# Altium schematic sheet hot.SchDoc
size A2
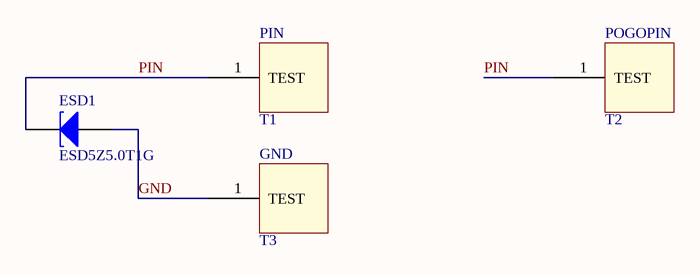
[diagram p0: hot.SchDoc]

## Parts
ESD1  ESD5Z5.0T1G  [LC-SOD-523]
GND  T3  [PIN]
PIN  T1  [PIN]
POGOPIN  T2  [POGOPIN]

## Nets
GND: ESD1.1(A) GND.1(TEST)
PIN: ESD1.2(K) PIN.1(TEST) POGOPIN.1(TEST)

## Library data of the parts
ESD1 = D Tunnel2: Tunnel Diode - Dependent Source Model; Published: 15-Apr-2002; LatestRevisionDate: 17-Jul-2002; LatestRevisionNote: Re-released for DXP Platform.; PackageReference: DIODE-0.4; Publisher: Altium Limited; PackageDescription: Diode, Thru-Hole; 2 Leads; 0.4 in Pin Spacing
GND PIN POGOPIN = TEST_POINT